# EAGLE design LM2623 (EAGLE 6.1)
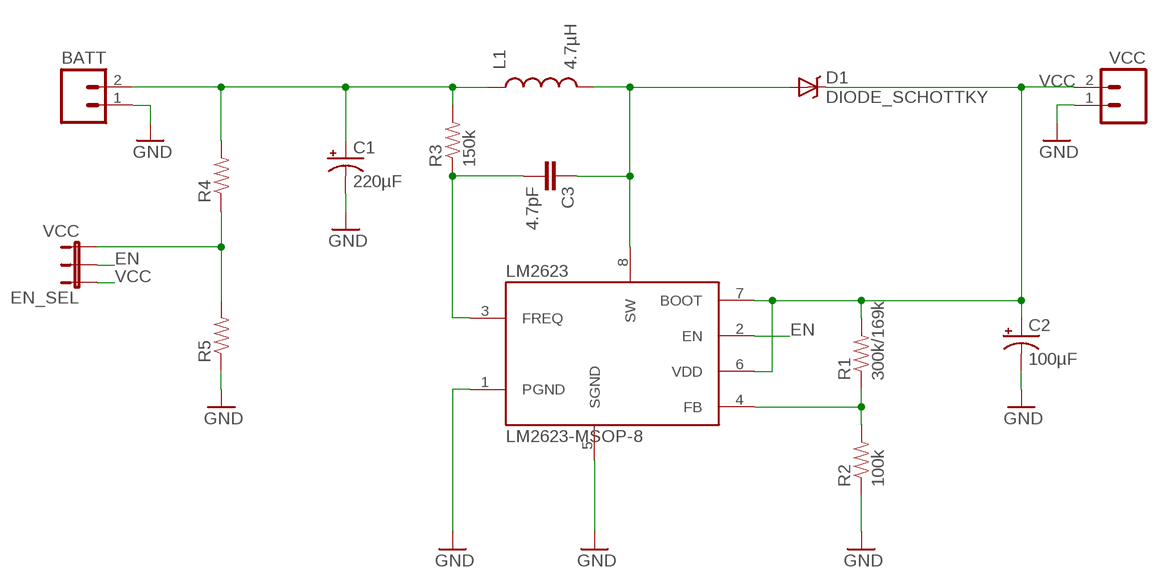
[diagram p0: schematic, sheet 1]

## Parts
BATT  M02PTH  [1X02]
C1  220µF  CAP_POL3528  [EIA3528]
C2  100µF  CAP_POL3528  [EIA3528]
C3  4.7pF  CAP0603-CAP  [0603-CAP]
D1  DIODE_SCHOTTKY  [DO-214AB]
EN_SEL  VCC  JUMPER-3SMD  [SJ_3]
L1  4.7µH  INDUCTOR-SRR7032  [INDUCTOR_SRR7032]
LM2623  LM2623-MSOP-8  [MSOP-8]
R1  300k/169k  RESISTOR0805-RES  [0805]
R2  100k  RESISTOR0805-RES  [0805]
R3  150k  RESISTOR0805-RES  [0805]
R4  RESISTOR0805-RES  [0805]
R5  RESISTOR0805-RES  [0805]
VCC  M02PTH  [1X02]

## Nets
EN: EN_SEL.2 LM2623.2(EN)
GND: BATT.1 C1.C(-) C2.C(-) LM2623.1(PGND) LM2623.5(SGND) R2.1 R5.1 VCC.1
N$1: C3.2 LM2623.3(FREQ) R3.1
N$2: C3.1 D1.A L1.1 LM2623.8(SW)
N$3: EN_SEL.3 R4.1 R5.2
N$4: LM2623.4(FB) R1.1 R2.2
VBAT: BATT.2 C1.A(+) L1.2 R3.2 R4.2
VCC: C2.A(+) D1.C EN_SEL.1 LM2623.6(VDD) LM2623.7(BOOT) R1.2 VCC.2

## Library data of the parts
BATT VCC = SparkFun:M02: Header 2 Standard 2-pin 0.1" header. Use with straight break away headers (SKU : PRT-00116), right angle break away headers (PRT-00553), swiss pins (PRT-00743), machine pins (PRT-00117), and female headers (PRT-00115). Molex polarized connector foot print use with SKU : PRT-08233 with associated crimp pins and housings.
C1 C2 = SparkFun:CAP_POL: Capacitor Polarized These are standard SMD and PTH capacitors. Normally 10uF, 47uF, and 100uF in electrolytic and tantalum varieties. Always verify the external diameter of the through hole cap, it varies with capacity, voltage, and manufacturer. The EIA devices should be standard.
C3 = SparkFun:CAP: Capacitor Standard 0603 ceramic capacitor, and 0.1" leaded capacitor.
D1 = OpenSpace:DIODE_SCHOTTKY
EN_SEL = SparkFun:JUMPER-3
L1 = OpenSpace:INDUCTOR
LM2623 = OpenSpace:LM2623
R1-R5 = SparkFun:RESISTOR: Resistor Basic schematic elements and footprints for 0603, 1206, and PTH resistors.

## Board
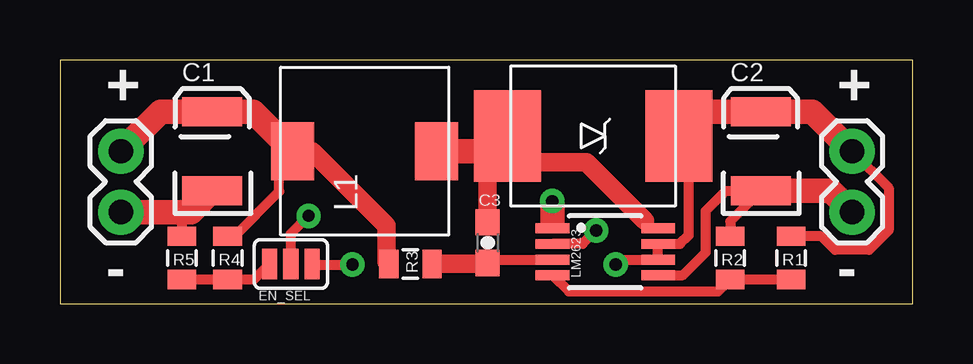
[diagram p1: board, top side]
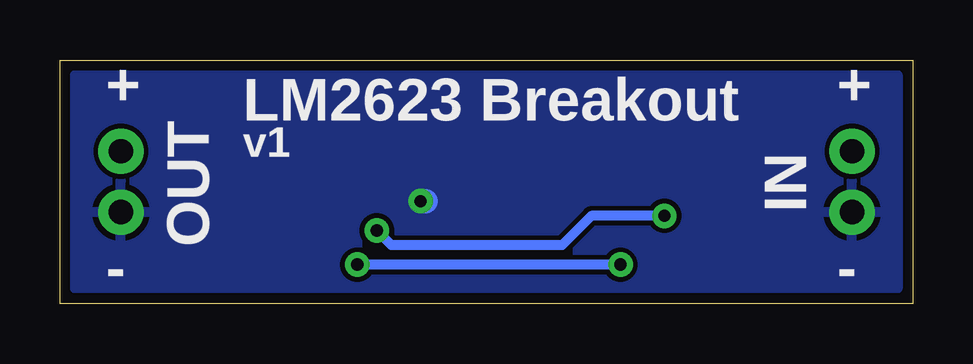
[diagram p2: board, bottom side, seen from below]

Size 35.56 x 10.15 mm. Coordinates in mm from the lower left corner, seen from the top.
Outline: 0,0 35.56,0 35.56,10.15 0,10.15 0,0
Copper layers (1*16): Top 0.035mm / dielectric 1.5mm / Bottom 0.035mm
Design rules: minimum track width 8mil, minimum drill 20mil, track to track 8mil, track to pad 8mil, pad to pad 8mil, via to via 8mil, smd to smd 8mil, copper to edge 10mil, drill to drill 8mil, minimum pad ring 12mil, minimum via ring 10mil, stop-mask expansion 4mil, vias tented up to drill 25mil, thermal gap 10mil

### Footprints (pad centres in the part's own frame; a part is rotated, then mirrored left to right if it is on the bottom)
1X02 = drill 1.016 pad 1.88: 1 0,0; 2 2.54,0
EIA3528 = smd 1.2 x 2.5: A 1.65,0; C -1.65,0
0603-CAP = smd 1.1 x 1: 1 -0.85,0; 2 0.85,0
DO-214AB = smd 2.794 x 3.81: A -3.568,0; C 3.568,0
SJ_3 = smd 0.635 x 1.27: 1 -0.889,0; 2 0,0; 3 0.889,0
INDUCTOR_SRR7032 = smd 2.4 x 1.8: 1 0,-3; 2 0,3
MSOP-8 = smd 0.41 x 1.4: 1 -0.975,-2.2; 2 -0.325,-2.2; 3 0.325,-2.2; 4 0.975,-2.2; 5 0.975,2.2; 6 0.325,2.2; 7 -0.325,2.2; 8 -0.975,2.2
0805 = smd 0.8 x 1.2: 1 -0.9,0; 2 0.9,0

### Placement (x,y rotation side)
BATT  2.54,3.81 90 top
C1  6.35,6.35 90 top
C2  29.21,6.35 90 top
C3  17.83,2.54 270 top
D1  22.23,6.99 0 top
EN_SEL  9.63,1.65 180 top
L1  12.7,6.35 90 top
LM2623  22.73,2.16 270 top
R1  30.48,1.91 90 top
R2  27.94,1.91 270 top
R3  14.61,1.65 180 top
R4  6.99,1.91 90 top
R5  5.08,1.91 270 top
VCC  33.02,3.81 90 top

### Tracks (layer width: path | path; a pad name or v marks a point on that pad's centre or on a via)
EN  (via drill 0.51)
  Top 0.406: LM2623.2 21.79,2.48 v22.35,3.05 | v10.36,3.66 9.63,2.92 EN_SEL.2
  Bottom 0.406: v22.35,3.05 21.74,2.44 14.63,2.44 13.41,3.66 v10.36,3.66
GND  (via drill 0.51)
  Top 0.406: 5.08,3.81 R5.1 | R2.1 27.94,3.43 C2.C 27.76,4.7 26.92,3.86 26.92,2.13 25.97,1.18 LM2623.5 | LM2623.1 20.53,3.44 20.52,3.45
  Top 1.016: BATT.1 5.08,3.81 5.46,3.81 C1.C | C2.C 32.13,4.7 VCC.1 | 20.52,3.45 v20.52,4.27
  Bottom 1.016: v20.52,4.27 20.32,4.27
  pour Bottom: 0.64,9.53 0.64,0.64 34.92,0.64 34.92,9.53
N$1
  Top 0.406: LM2623.3 17.98,1.83 C3.2
  Top 0.762: R3.1 17.79,1.65 C3.2
N$2
  Top 0.406: LM2623.8 24.7,3.13 24.38,3.45
  Top 0.762: 18.02,6.35 17.83,6.16 17.83,5.89 | 17.83,5.89 C3.1 | 24.38,3.45 21.95,5.89 17.83,5.89
  Top 1.016: L1.1 18.02,6.35 D1.A
N$3
  Top 0.406: R5.2 R4.1 8.09,1 EN_SEL.3
N$4
  Top 0.406: R1.1 R2.2 27.44,0.51 21.21,0.51 LM2623.4
VBAT
  Top 0.406: R4.2 7.28,2.81 9.14,4.67 9.14,5.79 L1.2
  Top 0.762: L1.2 10.52,6.35 13.61,3.25 13.61,1.74 R3.2
  Top 1.016: BATT.2 4.19,8 C1.A 8.05,8 L1.2
VCC  (via drill 0.51)
  Top 0.406: D1.C 26.21,6.57 26.21,2.85 25.85,2.48 LM2623.7 LM2623.6 23.37,1.83 v23.16,1.63 | v12.19,1.63 10.54,1.63 EN_SEL.1 | R1.2 31.74,2.81 32.31,2.23 33.73,2.23 34.54,3.05 34.54,4.83 VCC.2
  Top 1.016: D1.C 26.81,8 C2.A 31.37,8 VCC.2
  Bottom 0.406: v12.19,1.63 v23.16,1.63

### Text on the board
tPlace: + | + | - | -
bPlace: + | LM2623 Breakout | OUT | + | v1 | IN | - | -